# EAGLE board AM3352-SOM-EVB_Rev_E (EAGLE 4.16), part 1 of 3
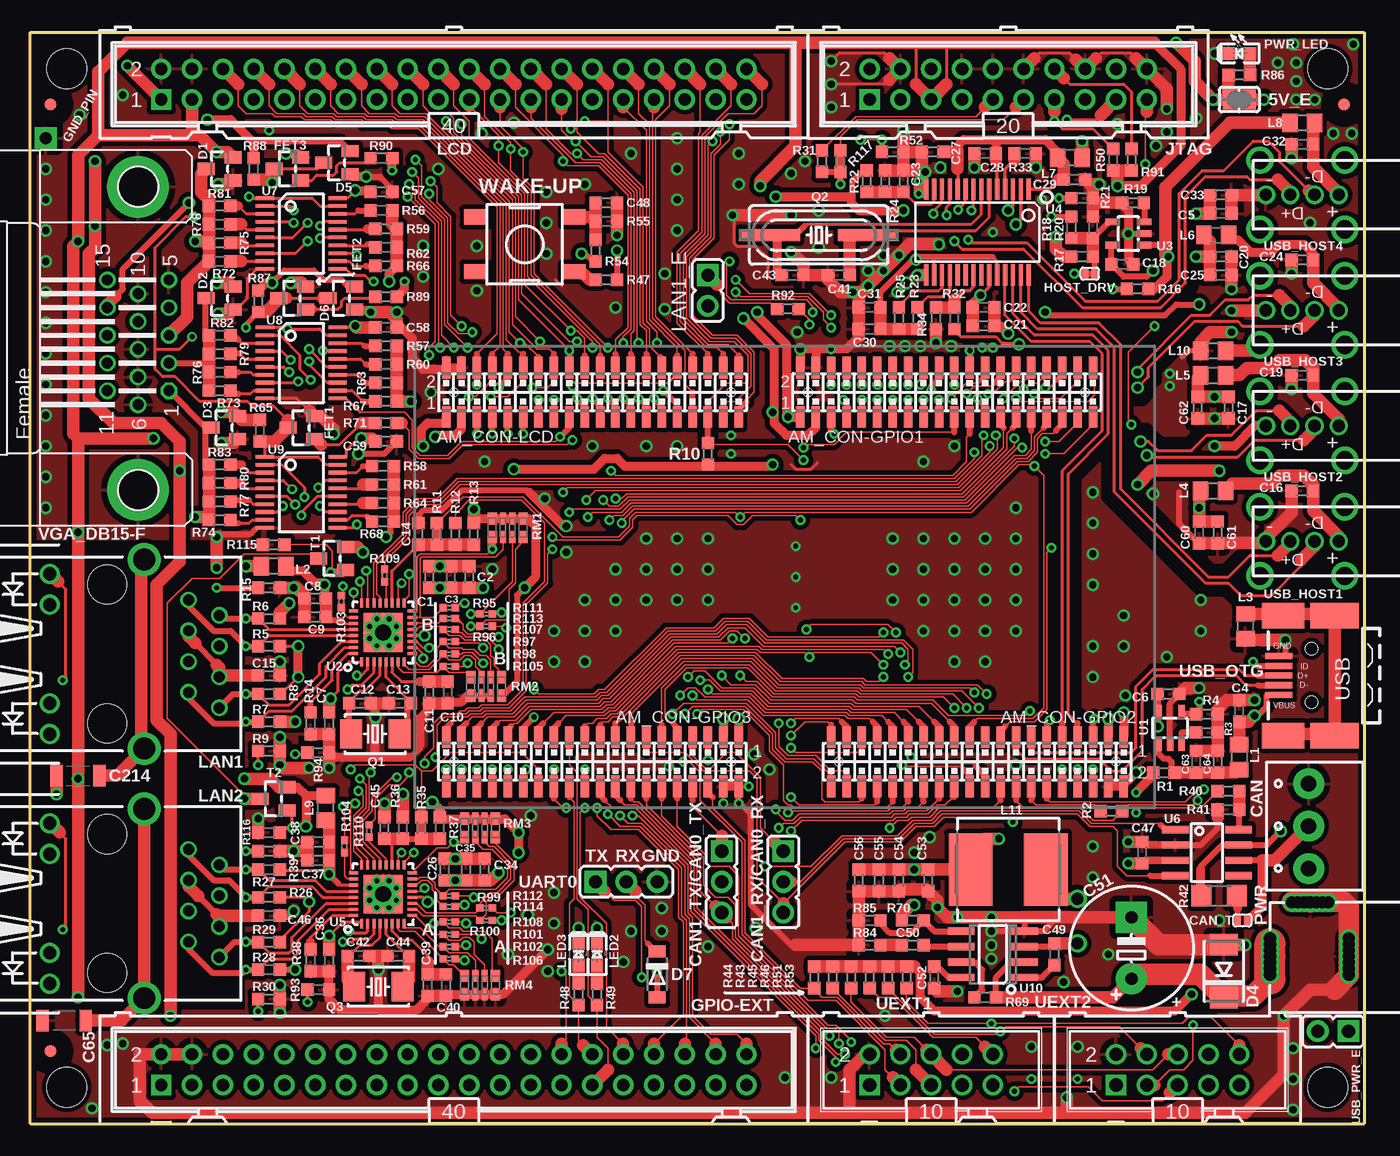
[diagram p2: board, top side]
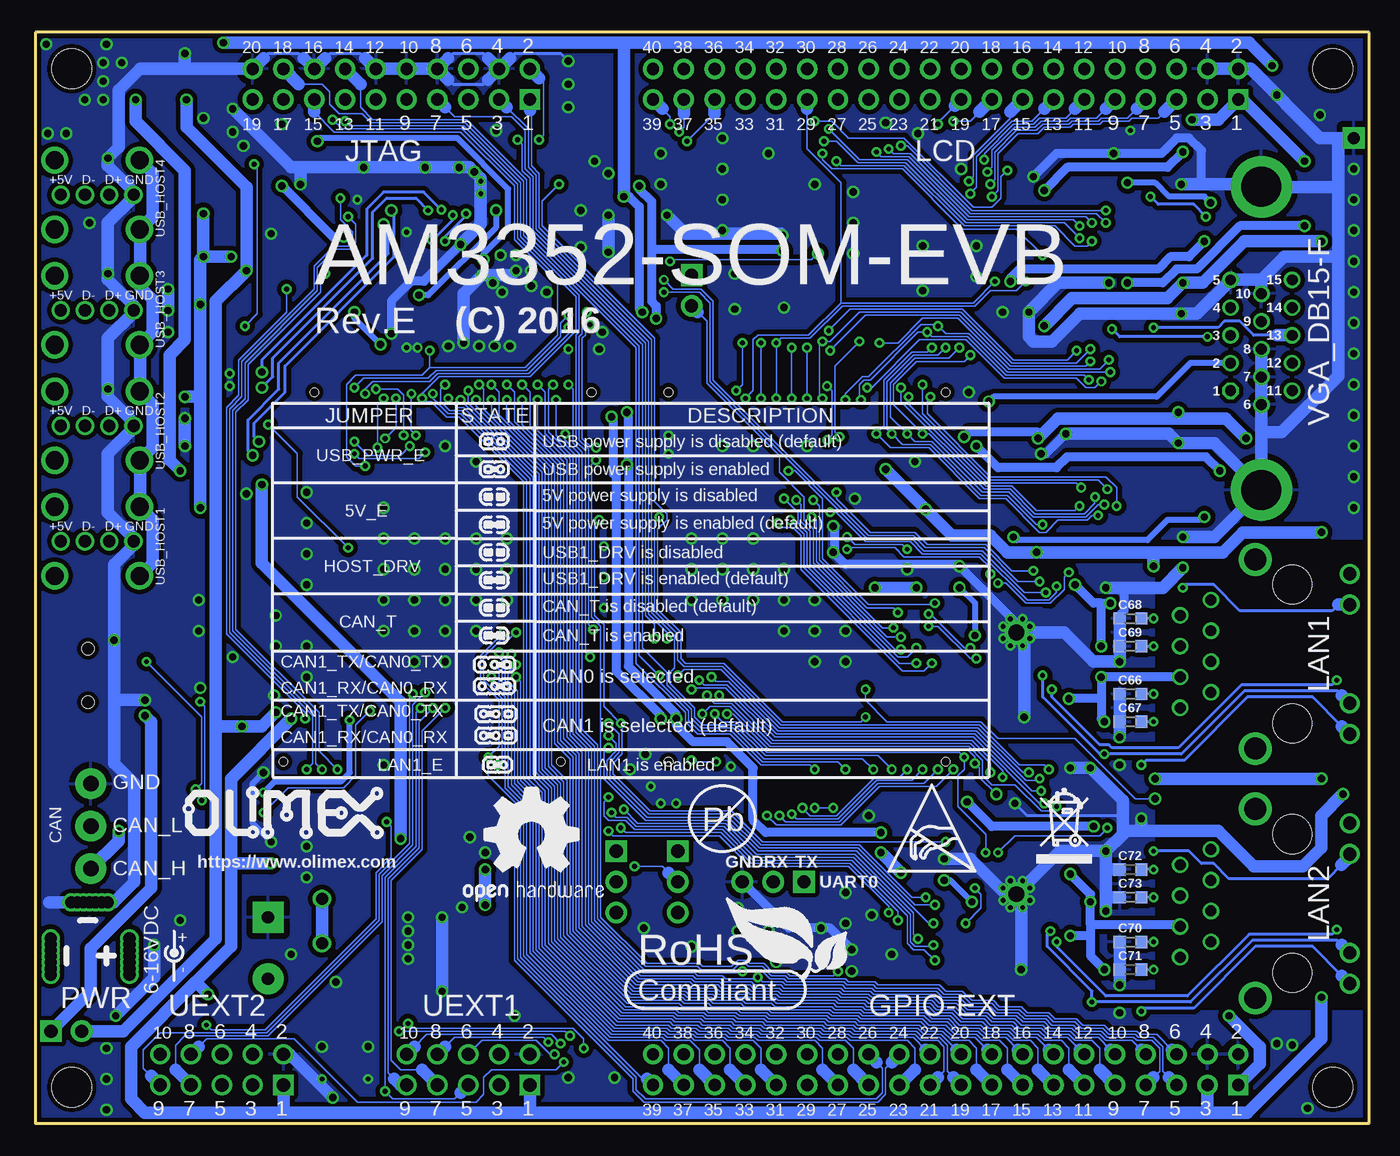
[diagram p3: board, bottom side, seen from below]

Size 110 x 90 mm. Coordinates in mm from the lower left corner, seen from the top.
Outline: 0,0 110,0 110,90 0,90 0,0
Copper layers (1+16): Top 0.035mm / dielectric 1.5mm / Bottom 0.035mm
Design rules "default": minimum track width 5mil, minimum drill 0.3mm, track to track 5mil, track to pad 5mil, pad to pad 5mil, via to via 5mil, smd to smd 1mil, copper to edge 10mil, drill to drill 8mil, minimum pad ring 8mil, minimum via ring 8mil, stop-mask expansion 4mil, vias tented up to drill 25mil, thermal gap 20mil
Net classes: 2 lan_sh: drill 0.762 mm
Holes 3.3 mm at 3,3 107,3 107,87 3,87
tRestrict: 25 lines

## Footprints (pad centres in the part's own frame; a part is rotated, then mirrored left to right if it is on the bottom)
SJ-CLOSE = smd 1.168 x 1.6: 1 -0.762,0; 2 0.762,0
AM3352-SOM-EVB = smd 0.7 x 1.8: 1-1 -27.94,13.208; 1-2 -27.94,17.272; 1-3 -26.67,13.208; 1-4 -26.67,17.272; 1-5 -25.4,13.208; 1-6 -25.4,17.272; 1-7 -24.13,13.208; 1-8 -24.13,17.272; 1-9 -22.86,13.208; 1-10 -22.86,17.272; 1-11 -21.59,13.208; 1-12 -21.59,17.272; 1-13 -20.32,13.208; 1-14 -20.32,17.272; 1-15 -19.05,13.208; 1-16 -19.05,17.272; 1-17 -17.78,13.208; 1-18 -17.78,17.272; 1-19 -16.51,13.208; 1-20 -16.51,17.272; 1-21 -15.24,13.208; 1-22 -15.24,17.272; 1-23 -13.97,13.208; 1-24 -13.97,17.272; 1-25 -12.7,13.208; 1-26 -12.7,17.272; 1-27 -11.43,13.208; 1-28 -11.43,17.272; 1-29 -10.16,13.208; 1-30 -10.16,17.272; 1-31 -8.89,13.208; 1-32 -8.89,17.272; 1-33 -7.62,13.208; 1-34 -7.62,17.272; 1-35 -6.35,13.208; 1-36 -6.35,17.272; 1-37 -5.08,13.208; 1-38 -5.08,17.272; 1-39 -3.81,13.208; 1-40 -3.81,17.272; 2-1 1.27,13.208; 2-2 1.27,17.272; 2-3 2.54,13.208; 2-4 2.54,17.272; 2-5 3.81,13.208; 2-6 3.81,17.272; 2-7 5.08,13.208; 2-8 5.08,17.272; 2-9 6.35,13.208; 2-10 6.35,17.272; 2-11 7.62,13.208; 2-12 7.62,17.272; 2-13 8.89,13.208; 2-14 8.89,17.272; 2-15 10.16,13.208; 2-16 10.16,17.272; 2-17 11.43,13.208; 2-18 11.43,17.272; 2-19 12.7,13.208; 2-20 12.7,17.272; 2-21 13.97,13.208; 2-22 13.97,17.272; 2-23 15.24,13.208; 2-24 15.24,17.272; 2-25 16.51,13.208; 2-26 16.51,17.272; 2-27 17.78,13.208; 2-28 17.78,17.272; 2-29 19.05,13.208; 2-30 19.05,17.272; 2-31 20.32,13.208; 2-32 20.32,17.272; 2-33 21.59,13.208; 2-34 21.59,17.272; 2-35 22.86,13.208; 2-36 22.86,17.272; 2-37 24.13,13.208; 2-38 24.13,17.272; 2-39 25.4,13.208; 2-40 25.4,17.272; 3-1 27.94,-13.208; 3-2 27.94,-17.272; 3-3 26.67,-13.208; 3-4 26.67,-17.272; 3-5 25.4,-13.208; 3-6 25.4,-17.272; 3-7 24.13,-13.208; 3-8 24.13,-17.272; 3-9 22.86,-13.208; 3-10 22.86,-17.272; 3-11 21.59,-13.208; 3-12 21.59,-17.272; 3-13 20.32,-13.208; 3-14 20.32,-17.272; 3-15 19.05,-13.208; 3-16 19.05,-17.272; 3-17 17.78,-13.208; 3-18 17.78,-17.272; 3-19 16.51,-13.208; 3-20 16.51,-17.272; 3-21 15.24,-13.208; 3-22 15.24,-17.272; 3-23 13.97,-13.208; 3-24 13.97,-17.272; 3-25 12.7,-13.208; 3-26 12.7,-17.272; 3-27 11.43,-13.208; 3-28 11.43,-17.272; 3-29 10.16,-13.208; 3-30 10.16,-17.272; 3-31 8.89,-13.208; 3-32 8.89,-17.272; 3-33 7.62,-13.208; 3-34 7.62,-17.272; 3-35 6.35,-13.208; 3-36 6.35,-17.272; 3-37 5.08,-13.208; 3-38 5.08,-17.272; 3-39 3.81,-13.208; 3-40 3.81,-17.272; 4-1 -3.81,-13.208; 4-2 -3.81,-17.272; 4-3 -5.08,-13.208; 4-4 -5.08,-17.272; 4-5 -6.35,-13.208; 4-6 -6.35,-17.272; 4-7 -7.62,-13.208; 4-8 -7.62,-17.272; 4-9 -8.89,-13.208; 4-10 -8.89,-17.272; 4-11 -10.16,-13.208; 4-12 -10.16,-17.272; 4-13 -11.43,-13.208; 4-14 -11.43,-17.272; 4-15 -12.7,-13.208; 4-16 -12.7,-17.272; 4-17 -13.97,-13.208; 4-18 -13.97,-17.272; 4-19 -15.24,-13.208; 4-20 -15.24,-17.272; 4-21 -16.51,-13.208; 4-22 -16.51,-17.272; 4-23 -17.78,-13.208; 4-24 -17.78,-17.272; 4-25 -19.05,-13.208; 4-26 -19.05,-17.272; 4-27 -20.32,-13.208; 4-28 -20.32,-17.272; 4-29 -21.59,-13.208; 4-30 -21.59,-17.272; 4-31 -22.86,-13.208; 4-32 -22.86,-17.272; 4-33 -24.13,-13.208; 4-34 -24.13,-17.272; 4-35 -25.4,-13.208; 4-36 -25.4,-17.272; 4-37 -26.67,-13.208; 4-38 -26.67,-17.272; 4-39 -27.94,-13.208; 4-40 -27.94,-17.272 | hole 0.7: -27.305,15.24; -4.445,15.24; 1.905,15.24; 24.765,15.24; 27.305,-15.24; 4.445,-15.24; -4.445,-15.24; -27.305,-15.24
C0603_DWS = smd 1.016 x 1.016: 1 -0.889,0; 2 0.889,0
E5-10,5 = drill 1.016 pad 2.54 round: + -2.54,0 | drill 1.016 pad 2.54 square: - 2.54,0
C1206_5MILS_WS_ISO = smd 1.016 x 1.778: 1 -1.778,0; 2 1.778,0
CON3/3.5MM = drill 1.27 pad 2.54 round: 1 -1.75,-0.5; 2 1.75,-0.5; 3 5.25,-0.5
JP2 = drill 1.1 pad 1.778 square: 1 -2.54,0 | drill 1.1 pad 1.778 round: 2 0,0; 3 2.54,0
SJ_1_SMALLER = smd 0.508 x 0.762: 1 -0.381,0; 2 0.381,0
SOT23C(BAT54S) = smd 1.4 x 1: 1 1.1,-0.95; 2 1.1,0.95; 3 -1.1,0
DO214AA = smd 1.778 x 2.286: A 2.177,0; C -2.177,0
SOD-123 = smd 1 x 1.4: A 1.9,0; C -1.9,0
SOT23 = smd 1.4 x 1: 1 1.1,-0.95; 2 1.1,0.95; 3 -1.1,0
FIDUCIAL-1X3 = smd 1 x 1: 1 0,0
TEST_PAD40/70/SQUARE = drill 1.016 pad 1.778 square: P$1 0,0
ML40 = drill 1.016 pad 1.676 square: 1 -24.13,-1.27 | drill 1.016 pad 1.676 round: 2 -24.13,1.27; 3 -21.59,-1.27; 4 -21.59,1.27; 5 -19.05,-1.27; 6 -19.05,1.27; 7 -16.51,-1.27; 8 -16.51,1.27; 9 -13.97,-1.27; 10 -13.97,1.27; 11 -11.43,-1.27; 12 -11.43,1.27; 13 -8.89,-1.27; 14 -8.89,1.27; 15 -6.35,-1.27; 16 -6.35,1.27; 17 -3.81,-1.27; 18 -3.81,1.27; 19 -1.27,-1.27; 20 -1.27,1.27; 21 1.27,-1.27; 22 1.27,1.27; 23 3.81,-1.27; 24 3.81,1.27; 25 6.35,-1.27; 26 6.35,1.27; 27 8.89,-1.27; 28 8.89,1.27; 29 11.43,-1.27; 30 11.43,1.27; 31 13.97,-1.27; 32 13.97,1.27; 33 16.51,-1.27; 34 16.51,1.27; 35 19.05,-1.27; 36 19.05,1.27; 37 21.59,-1.27; 38 21.59,1.27; 39 24.13,-1.27; 40 24.13,1.27
SJ_1_SMALLER_CLOSE = smd 0.508 x 0.762: 1 -0.381,0; 2 0.381,0
ML20-MALE = drill 1.016 pad 1.676 square: 1 -11.43,-1.27 | drill 1.016 pad 1.676 round: 2 -11.43,1.27; 3 -8.89,-1.27; 4 -8.89,1.27; 5 -6.35,-1.27; 6 -6.35,1.27; 7 -3.81,-1.27; 8 -3.81,1.27; 9 -1.27,-1.27; 10 -1.27,1.27; 11 1.27,-1.27; 12 1.27,1.27; 13 3.81,-1.27; 14 3.81,1.27; 15 6.35,-1.27; 16 6.35,1.27; 17 8.89,-1.27; 18 8.89,1.27; 19 11.43,-1.27; 20 11.43,1.27
L0805_5MIL_DWS = smd 1.27 x 1.524: 1 -1.016,0; 2 1.016,0
8X8MM_3131 = smd 3.6 x 6: 1 -3.1,0; 2 3.1,0
RJLBC-060TC1 = drill 0.9 round: 1 -4.455,6.7; 2 -3.185,9.24; 3 -1.915,6.7; 4 -0.645,9.24; 5 0.625,6.7; 6 1.895,9.24; 7 3.165,6.7; 8 4.435,9.24 | drill 1.1 round: AG 4.07,-4.748; AY -6.61,-4.748; KG 6.61,-4.748; KY -4.07,-4.748 | drill 1.8 round: GND1 -7.8,3.05; GND2 7.8,3.05 | hole 3.2: -5.715,0; 5.715,0
JP1 = drill 1.1 pad 1.778 square: 1 0,-1.27 | drill 1.1 pad 1.778 round: 2 0,1.27
LED_0603 = smd 1.016 x 1.016: A 0.889,0; C -0.889,0
PWR_JACK_UNI_MILLING = drill 1 round: + 0,4.75; +1 0,5.25; +2 0,5.75; +3 0,6.25; +4 0,4.25; +5 0,3.75; +6 0,3.25; - -6.5,4.75; -1 -6.5,5.25; -2 -6.5,5.75; -3 -6.5,4.25; -4 -6.5,3.75; -5 -6.5,6.25; -6 -6.5,3.25; -- -3.3,0.3; --1 -3.8,0.3; --2 -4.3,0.3; --3 -4.8,0.3; --4 -2.8,0.3; --5 -2.3,0.3; --6 -1.8,0.3
LED-0603 = smd 1.016 x 1.016: A 0.889,0; C -0.889,0
HCX-4S = smd 1.8 x 2.4: 1 -2,0; 2 2,0
HC49/SMD2_THIN = smd 5 x 1: 1 -4.064,0; 2 4.064,0
R0603_5MIL_DWS = smd 1.016 x 1.016: 1 -0.889,0; 2 0.889,0
0603_0R = smd 1.016 x 1.016: 1 -0.889,0; 2 0.889,0
R1206_5MIL_WS = smd 1.651 x 1.778: 1 -1.46,0; 2 1.46,0
R0402_TI = smd 0.61 x 0.584: 1 -0.508,0; 2 0.508,0
R_MATRIX_4 = smd 0.762 x 1.016: 1.1 -1.27,-0.762; 1.2 -1.27,0.762; 4.1 1.27,-0.762; 4.2 1.27,0.762 | smd 0.508 x 1.016: 2.1 -0.381,-0.762; 2.2 -0.381,0.762; 3.1 0.381,-0.762; 3.2 0.381,0.762
SOT-23 = smd 1.4 x 1: 1 1.1,-0.95; 2 1.1,0.95; 3 -1.1,0
SOT23-5 = smd 1.2 x 0.55: 1 1.3,-0.95; 2 1.3,0; 3 1.3,0.95; 4 -1.3,0.95; 5 -1.3,-0.95
QFN-32(DRILLS) = smd 0.25 x 0.75: 1 -1.75,-2.425; 2 -1.25,-2.425; 3 -0.75,-2.425; 4 -0.25,-2.425; 5 0.25,-2.425; 6 0.75,-2.425; 7 1.25,-2.425; 8 1.75,-2.425; 17 1.75,2.425; 18 1.25,2.425; 19 0.75,2.425; 20 0.25,2.425; 21 -0.25,2.425; 22 -0.75,2.425; 23 -1.25,2.425; 24 -1.75,2.425 | smd 0.75 x 0.25: 9 2.425,-1.75; 10 2.425,-1.25; 11 2.425,-0.75; 12 2.425,-0.25; 13 2.425,0.25; 14 2.425,0.75; 15 2.425,1.25; 16 2.425,1.75; 25 -2.425,1.75; 26 -2.425,1.25; 27 -2.425,0.75; 28 -2.425,0.25; 29 -2.425,-0.25; 30 -2.425,-0.75; 31 -2.425,-1.25; 32 -2.425,-1.75 | drill 1.3 round: EP1 0,0 | drill 0.4 round: EP2 -0.5,1.1; EP3 0.5,1.1; EP4 1.1,0.5; EP5 1.1,-0.5; EP6 0.5,-1.1; EP7 -0.5,-1.1; EP8 -1.1,-0.5; EP9 -1.1,0.5 | smd 3.2 x 3.2: EXP_PAD 0,0
SSOP28 = smd 0.35 x 1.75: 1 -4.225,-3.525; 2 -3.575,-3.525; 3 -2.925,-3.525; 4 -2.275,-3.525; 5 -1.625,-3.525; 6 -0.975,-3.525; 7 -0.325,-3.525; 8 0.325,-3.525; 9 0.975,-3.525; 10 1.625,-3.525; 11 2.275,-3.525; 12 2.925,-3.525; 13 3.575,-3.525; 14 4.225,-3.525; 15 4.225,3.525; 16 3.575,3.525; 17 2.925,3.525; 18 2.275,3.525; 19 1.625,3.525; 20 0.975,3.525; 21 0.325,3.525; 22 -0.325,3.525; 23 -0.975,3.525; 24 -1.625,3.525; 25 -2.275,3.525; 26 -2.925,3.525; 27 -3.575,3.525; 28 -4.225,3.525
SO-08 = smd 0.6 x 2.2: 1 -1.905,-2.6; 2 -0.635,-2.6; 3 0.635,-2.6; 4 1.905,-2.6; 5 1.905,2.6; 6 0.635,2.6; 7 -0.635,2.6; 8 -1.905,2.6
PW = smd 0.3 x 1.5: 1 -2.925,-3; 2 -2.275,-3; 3 -1.625,-3; 4 -0.975,-3; 5 -0.325,-3; 6 0.325,-3; 7 0.975,-3; 8 1.625,-3; 9 2.275,-3; 10 2.925,-3; 11 2.925,3; 12 2.275,3; 13 1.625,3; 14 0.975,3; 15 0.325,3; 16 -0.325,3; 17 -0.975,3; 18 -1.625,3; 19 -2.275,3; 20 -2.925,3
SOIC8 = smd 0.6 x 2.2: 1 -1.905,-2.6; 2 -0.635,-2.6; 3 0.635,-2.6; 4 1.905,-2.6; 5 1.905,2.6; 6 0.635,2.6; 7 -0.635,2.6; 8 -1.905,2.6
ML10-MALE = drill 1.1 pad 1.676 square: 1 -5.08,-1.27 | drill 1.1 pad 1.676 round: 2 -5.08,1.27; 3 -2.54,-1.27; 4 -2.54,1.27; 5 0,-1.27; 6 0,1.27; 7 2.54,-1.27; 8 2.54,1.27; 9 5.08,-1.27; 10 5.08,1.27
USB_A_VERTICAL_PTH = drill 1 round: 1 3.45,12.75; 2 3.45,14.75; 3 3.45,16.75; 4 3.45,18.75 | drill 1.5 round: P$1 0.6,12.25; P$2 6.3,12.25; P$3 6.3,19.25; P$4 0.6,19.25
USB_MINI_9PIN = smd 2.25 x 0.5: D+ -3.722,0; D- -3.722,-0.8; GND -3.722,1.6; ID -3.722,0.8; VBUS -3.722,-1.6 | smd 4 x 2.1: GND1 0.884,-4.95; GND3 0.884,4.95 | smd 3.5 x 2.1: GND2 -3.366,-4.95; GND4 -3.366,4.95 | hole 1: -1.016,-2.2; -1.016,2.2
DB15-F_22MM = drill 0.9 octagon: 1 4.329,6.35 | drill 0.9 round: 2 2.043,6.35; 3 -0.243,6.35; 4 -2.529,6.35; 5 -4.815,6.35; 6 5.472,3.81; 7 3.186,3.81; 8 0.9,3.81; 9 -1.386,3.81; 10 -3.672,3.81; 11 4.329,1.27; 12 2.043,1.27; 13 -0.243,1.27; 14 -2.529,1.27; 15 -4.815,1.27 | drill 3.302 pad 5.08 round: GND1 -12.497,3.81; GND2 12.497,3.81
T1157 = smd 1.27 x 1.905: 1 -2.25,4.054; 2 2.25,4.054; 3 2.25,-4.054; 4 -2.25,-4.054

## Placement (x,y rotation side)
5V_E  Close  [SJ-CLOSE]  99.69,84.45 180 top
AM3352-SOM-EVB-PLATFORM  4XGPH127SMT-02X20(PA-V16X-2X20-LF)  [AM3352-SOM-EVB]  62.23,45.09 0 top
C1  100nF  [C0603_DWS]  32.89,45.09 270 top
C2  22uF/6.3V  [C0603_DWS]  36.2,45.09 270 top
C3  22uF/6.3V  [C0603_DWS]  34.67,45.09 270 top
C4  100nF  [C0603_DWS]  99.69,34.04 90 top
C5  22uF/6.3V  [C0603_DWS]  98.17,75.06 0 top
C6  100nF  [C0603_DWS]  93.85,35.43 0 top
C7  100nF  [C0603_DWS]  24.64,33.02 90 top
C8  100nF  [C0603_DWS]  23.5,43.31 0 top
C9  22uF/6.3V  [C0603_DWS]  23.5,41.78 0 top
C10  470pF  [C0603_DWS]  34.42,35.56 90 top
C11  1uF  [C0603_DWS]  32.89,35.56 90 top
C12  33pF  [C0603_DWS]  27.18,34.67 180 top
C13  33pF  [C0603_DWS]  30.48,34.67 0 top
C14  NA  [C0603_DWS]  32,48.64 270 top
C15  22nF  [C0603_DWS]  19.68,36.96 180 top
C16  100nF  [C0603_DWS]  104.9,52.2 180 top
C17  22uF/6.3V  [C0603_DWS]  98.81,59.05 270 top
C18  22uF/6.3V  [C0603_DWS]  90.04,70.87 0 top
C19  100nF  [C0603_DWS]  104.9,61.72 180 top
C20  22uF/6.3V  [C0603_DWS]  98.17,71.5 0 top
C21  22uF/6.3V  [C0603_DWS]  78.61,65.79 0 top
C22  100nF  [C0603_DWS]  78.61,67.31 0 top
C23  1uF  [C0603_DWS]  72.01,77.72 270 top
C24  100nF  [C0603_DWS]  104.9,71.25 180 top
C25  22uF/6.3V  [C0603_DWS]  98.17,69.98 0 top
C26  100nF  [C0603_DWS]  34.16,20.95 270 top
C27  100nF  [C0603_DWS]  74.42,80.14 180 top
C28  100nF  [C0603_DWS]  78.74,80.01 180 top
C29  100nF  [C0603_DWS]  86.11,77.85 0 top
C30  22uF/6.3V  [C0603_DWS]  69.22,65.53 180 top
C31  100nF  [C0603_DWS]  69.22,67.31 180 top
C32  100nF  [C0603_DWS]  104.9,80.77 180 top
C33  22uF/6.3V  [C0603_DWS]  98.17,76.58 0 top
C34  22uF/6.3V  [C0603_DWS]  37.47,20.95 270 top
C35  22uF/6.3V  [C0603_DWS]  35.94,20.95 270 top
C36  100nF  [C0603_DWS]  24.64,13.46 90 top
C37  100nF  [C0603_DWS]  23.75,21.72 0 top
C38  22uF/6.3V  [C0603_DWS]  23.75,23.24 0 top
C39  470pF  [C0603_DWS]  32.77,11.43 90 top
C40  1uF  [C0603_DWS]  34.29,11.43 90 top
C41  33pF  [C0603_DWS]  66.67,69.98 0 top
C42  33pF  [C0603_DWS]  27.05,13.84 180 top
C43  33pF  [C0603_DWS]  62.87,69.98 180 top
C44  33pF  [C0603_DWS]  30.35,13.84 0 top
C45  NA  [C0603_DWS]  29.21,24.38 270 top
C46  22nF  [C0603_DWS]  19.68,17.14 180 top
C47  100nF  [C0603_DWS]  91.69,22.35 90 top
C48  100nF  [C0603_DWS]  47.5,75.95 0 top
C49  10nF  [C0603_DWS]  84.45,13.97 90 top
C50  3.3nF  [C0603_DWS]  72.77,14.73 180 top
C51  470uF/25V/LOWESR/105C  [E5-10,5]  90.81,14.48 90 top
C52  100nF  [C0603_DWS]  74.55,12.06 270 top
C53  22uF/6.3V  [C0603_DWS]  74.04,20.07 270 top
C54  22uF/6.3V  [C0603_DWS]  71.63,20.07 270 top
C55  22uF/6.3V  [C0603_DWS]  69.98,20.07 270 top
C56  22uF/6.3V  [C0603_DWS]  68.33,20.07 270 top
C57  100nF  [C0603_DWS]  28.96,76.83 0 top
C58  100nF  [C0603_DWS]  29.34,65.66 0 top
C59  100nF  [C0603_DWS]  29.34,56.26 0 top
C60  22uF/6.3V  [C0603_DWS]  96.39,48.77 270 top
C61  22uF/6.3V  [C0603_DWS]  97.92,48.77 270 top
C62  22uF/6.3V  [C0603_DWS]  96.27,59.05 270 top
C63  22uF/6.3V  [C0603_DWS]  96.14,29.84 90 top
C64  22uF/6.3V  [C0603_DWS]  97.92,29.84 90 top
C65  1nF/2kV/X7R/1206  [C1206_5MILS_WS_ISO]  2.79,8.51 0 top
C66  NA  [C0603_DWS]  19.68,35.43 0 bottom
C67  NA  [C0603_DWS]  19.68,33.15 0 bottom
C68  NA  [C0603_DWS]  19.68,41.66 0 bottom
C69  NA  [C0603_DWS]  19.68,39.37 0 bottom
C70  NA  [C0603_DWS]  19.68,14.99 0 bottom
C71  NA  [C0603_DWS]  19.68,12.7 0 bottom
C72  NA  [C0603_DWS]  19.68,20.95 0 bottom
C73  NA  [C0603_DWS]  19.68,18.67 0 bottom
C214  1nF/2kV/X7R/1206  [C1206_5MILS_WS_ISO]  3.94,28.7 0 top
CAN  TB3-3.5mm  [CON3/3.5MM]  105.92,26.29 270 top
CAN1_RX/CAN0_RX  HN1x3(CAN1_RX:Close/CAN0_RX:Open)  [JP2]  62.1,19.94 270 top
CAN1_TX/CAN0_TX  HN1x3(CAN1_TX:Close/CAN0_TX:Open)  [JP2]  57.02,19.94 270 top
CAN_T  Open  [SJ_1_SMALLER]  99.95,16.76 0 top
D1  BAT54S  [SOT23C(BAT54S)]  15.62,78.74 0 top
D2  BAT54S  [SOT23C(BAT54S)]  15.62,68.07 0 top
D3  BAT54S  [SOT23C(BAT54S)]  16,57.4 0 top
D4  SMBJ16A  [DO214AA]  98.42,12.57 90 top
D5  BAT54S  [SOT23C(BAT54S)]  25.27,79.25 0 top
D6  BAT54S  [SOT23C(BAT54S)]  25.65,68.07 0 top
D7  1N5819(S4SOD-123)  [SOD-123]  51.69,12.32 270 top
FET1  BSS138  [SOT23]  22.35,57.4 0 top
FET2  BSS138  [SOT23]  21.59,68.07 0 top
FET3  BSS138  [SOT23]  21.21,78.74 0 top
FID1  FIDUCIAL  [FIDUCIAL-1X3]  108.33,84.07 180 top
FID2  FIDUCIAL  [FIDUCIAL-1X3]  1.65,84.07 180 top
FID3  FIDUCIAL  [FIDUCIAL-1X3]  1.65,5.97 180 top
GND_PIN  TESTPAD3  [TEST_PAD40/70/SQUARE]  1.27,81.28 180 top
GPIO-EXT  BH40S  [ML40]  34.92,4.45 0 top
HOST_DRV  Close  [SJ_1_SMALLER_CLOSE]  87.38,70.1 0 top
JTAG  ML20  [ML20-MALE]  80.64,85.72 0 top
L1  FB0805/600R/2A  [L0805_5MIL_DWS]  99.69,30.23 270 top
L2  FB0805/600R/2A  [L0805_5MIL_DWS]  20.07,45.97 180 top
L3  FB0805/600R/200mA(201209-601)  [L0805_5MIL_DWS]  100.2,41.02 90 top
L4  FB0805/600R/2A  [L0805_5MIL_DWS]  97.54,52.2 0 top
L5  FB0805/600R/2A  [L0805_5MIL_DWS]  97.54,61.72 0 top
L6  FB0805/600R/2A  [L0805_5MIL_DWS]  97.79,73.28 0 top
L7  FB0805/600R/2A  [L0805_5MIL_DWS]  85.72,79.63 180 top
L8  FB0805/600R/2A  [L0805_5MIL_DWS]  104.9,82.55 0 top
L9  FB0805/600R/2A  [L0805_5MIL_DWS]  24.38,26.04 90 top
L10  FB0805/600R/2A  [L0805_5MIL_DWS]  97.54,63.75 0 top
L11  10uH/3.15A/20%  [8X8MM_3131]  80.64,20.95 180 top
LAN1  RJLBC-060TC1  [RJLBC-060TC1]  6.35,38.73 270 top
LAN1_E  HN1x2  [JP1]  55.88,68.71 180 top
LAN2  RJLBC-060TC1  [RJLBC-060TC1]  6.35,18.16 270 top
LCD  BH40S  [ML40]  34.92,85.72 0 top
LED2  LED/Red/0603  [LED_0603]  46.74,13.97 270 top
LED3  LED/Yellow/0603  [LED_0603]  45.21,13.97 270 top
PWR  YDJ-1136  [PWR_JACK_UNI_MILLING]  102.23,18.54 180 top
PWR_LED  LED/Red/0603  [LED-0603]  99.69,88.27 0 top
Q1  E4SB25.000F20E15  [HCX-4S]  28.45,32.13 180 top
Q2  Q12.000MHz/HC-49SM/SMD/20ppm/20pF  [HC49/SMD2_THIN]  65.02,73.28 0 top
Q3  E4SB25.000F20E15  [HCX-4S]  28.7,11.3 180 top
R1  2.2k/1%  [R0603_5MIL_DWS]  93.47,28.96 0 top
R2  NA  [R0603_5MIL_DWS]  89.15,25.78 180 top
R3  13k/1%  [R0603_5MIL_DWS]  97.03,32.26 180 top
R4  10k  [R0603_5MIL_DWS]  97.03,33.78 180 top
R5  49.9R/1%  [R0603_5MIL_DWS]  19.68,39.37 0 top
R6  49.9R/1%  [R0603_5MIL_DWS]  19.68,41.66 0 top
R7  49.9R/1%  [R0603_5MIL_DWS]  19.68,33.15 0 top
R8  49.9R/1%  [R0603_5MIL_DWS]  19.68,35.43 0 top
R9  549R/1%  [R0603_5MIL_DWS]  19.68,30.73 0 top
R10  4.99k/1%  [R0603_5MIL_DWS]  55.88,55.24 90 top
R11  0R(Board_Mounted)  [0603_0R]  33.53,48.64 270 top
R12  NA  [R0603_5MIL_DWS]  35.05,48.64 270 top
R13  NA  [R0603_5MIL_DWS]  36.58,48.64 270 top
R14  12.1k/1%  [R0603_5MIL_DWS]  23.11,33.02 90 top
R15  549R/1%  [R0603_5MIL_DWS]  19.68,44.2 0 top
R16  2.2k/1%  [R0603_5MIL_DWS]  91.31,68.83 0 top
R17  NA  [R0603_5MIL_DWS]  86.74,71.5 0 top
R18  NA  [R0603_5MIL_DWS]  85.85,73.91 270 top
R19  6.8k/1%  [R0603_5MIL_DWS]  90.93,75.95 0 top
R20  10k  [R0603_5MIL_DWS]  87.63,73.91 270 top
R21  10k  [R0603_5MIL_DWS]  86.74,76.33 0 top
R22  10k  [R0603_5MIL_DWS]  68.96,77.72 90 top
R23  10k  [R0603_5MIL_DWS]  73.15,66.42 90 top
R24  NA(47k)  [R0603_5MIL_DWS]  70.48,77.72 90 top
R25  10k  [R0603_5MIL_DWS]  71.63,66.42 90 top
R26  49.9R/1%  [R0603_5MIL_DWS]  19.68,18.67 0 top
R27  49.9R/1%  [R0603_5MIL_DWS]  19.68,20.95 0 top
R28  49.9R/1%  [R0603_5MIL_DWS]  19.68,12.7 0 top
R29  49.9R/1%  [R0603_5MIL_DWS]  19.68,14.99 0 top
R30  549R/1%  [R0603_5MIL_DWS]  19.68,10.29 0 top
R31  22R  [R0603_5MIL_DWS]  65.28,79.38 90 top
R32  NA(5.1k)  [R0603_5MIL_DWS]  76.2,66.42 270 top
R33  680R/1%  [R0603_5MIL_DWS]  82.04,80.01 180 top
R34  NA(10k)  [R0603_5MIL_DWS]  74.68,66.42 90 top
R35  0R(Board_Mounted)  [0603_0R]  32.26,24.38 270 top
R36  NA  [R0603_5MIL_DWS]  30.73,24.38 270 top
R37  NA  [R0603_5MIL_DWS]  33.78,24.38 270 top
R38  12.1k/1%  [R0603_5MIL_DWS]  23.11,13.46 90 top
R39  549R/1%  [R0603_5MIL_DWS]  19.68,22.48 0 top
R40  NA  [R0603_5MIL_DWS]  98.81,27.43 180 top
R41  10k  [R0603_5MIL_DWS]  98.81,25.91 180 top
R42  120R  [R1206_5MIL_WS]  98.04,18.8 180 top
R43  NA  [R0603_5MIL_DWS]  66.17,12.06 90 top
R44  NA  [R0603_5MIL_DWS]  64.64,12.06 90 top
R45  NA  [R0603_5MIL_DWS]  67.69,12.06 90 top
R46  NA  [R0603_5MIL_DWS]  69.22,12.06 90 top
R47  2.2k/1%  [R0603_5MIL_DWS]  47.5,69.6 0 top
R48  2.2k/1%  [R0603_5MIL_DWS]  45.21,10.67 90 top
R49  2.2k/1%  [R0603_5MIL_DWS]  46.74,10.67 90 top
R50  10k  [R0603_5MIL_DWS]  89.28,79.5 270 top
R51  NA  [R0603_5MIL_DWS]  70.74,12.06 90 top
R52  NA(10k)  [R0603_5MIL_DWS]  71.12,80.14 180 top
R53  NA  [R0603_5MIL_DWS]  72.26,12.06 90 top
R54  49.9R/1%  [R0603_5MIL_DWS]  46.61,72.01 90 top
R55  NA  [R0603_5MIL_DWS]  47.5,74.42 0 top
R56  71.5k/1%  [R0603_5MIL_DWS]  28.96,75.31 0 top
R57  71.5k/1%  [R0603_5MIL_DWS]  29.34,64.14 0 top
R58  71.5k/1%  [R0603_5MIL_DWS]  29.08,54.23 0 top
R59  35.7k/1%  [R0603_5MIL_DWS]  29.34,73.79 0 top
R60  35.7k/1%  [R0603_5MIL_DWS]  29.34,62.61 0 top
R61  35.7k/1%  [R0603_5MIL_DWS]  29.08,52.7 0 top
R62  17.8k/1%  [R0603_5MIL_DWS]  29.34,72.26 0 top
R63  17.8k/1%  [R0603_5MIL_DWS]  29.34,61.09 0 top
R64  17.8k/1%  [R0603_5MIL_DWS]  29.08,51.18 0 top
R65  1.05k/1%  [R0603_5MIL_DWS]  18.92,57.15 90 top
R66  8.66k/1%  [R0603_5MIL_DWS]  29.34,70.74 0 top
R67  8.66k/1%  [R0603_5MIL_DWS]  29.34,59.56 0 top
R68  8.66k/1%  [R0603_5MIL_DWS]  29.08,49.66 0 top
R69  10k  [R0603_5MIL_DWS]  78.74,10.41 180 top
R70  4.99k/1%  [R0603_5MIL_DWS]  72.77,16.76 180 top
R71  49.9R/1%  [R0603_5MIL_DWS]  29.34,57.78 180 top
R72  4.32k/1%  [R0603_5MIL_DWS]  15.62,71.12 180 top
R73  4.32k/1%  [R0603_5MIL_DWS]  15.62,60.45 180 top
R74  4.32k/1%  [R0603_5MIL_DWS]  15.62,49.78 180 top
R75  2.2k/1%  [R0603_5MIL_DWS]  15.62,72.64 180 top
R76  2.2k/1%  [R0603_5MIL_DWS]  15.62,61.98 180 top
R77  2.2k/1%  [R0603_5MIL_DWS]  15.62,51.31 180 top
R78  1.05k/1%  [R0603_5MIL_DWS]  15.62,74.17 180 top
R79  1.05k/1%  [R0603_5MIL_DWS]  15.62,63.5 180 top
R80  1.05k/1%  [R0603_5MIL_DWS]  15.62,52.83 180 top
R81  549R/1%  [R0603_5MIL_DWS]  15.62,75.69 180 top
R82  549R/1%  [R0603_5MIL_DWS]  15.62,65.02 180 top
R83  549R/1%  [R0603_5MIL_DWS]  15.62,54.36 180 top
R84  2.2k/1%  [R0603_5MIL_DWS]  69.22,14.73 180 top
R85  1.05k/1%  [R0603_5MIL_DWS]  69.22,16.76 180 top
R86  2.2k/1%  [R0603_5MIL_DWS]  99.69,86.49 0 top
R87  1.05k/1%  [R0603_5MIL_DWS]  18.8,67.82 90 top
R88  1.05k/1%  [R0603_5MIL_DWS]  18.41,78.74 90 top
R89  49.9R/1%  [R0603_5MIL_DWS]  29.34,68.2 180 top
R90  49.9R/1%  [R0603_5MIL_DWS]  28.96,79.63 180 top
R91  10k  [R0603_5MIL_DWS]  90.81,79.5 270 top
R92  0R  [R0603_5MIL_DWS]  62.48,67.18 0 top
R93  10k  [R0603_5MIL_DWS]  23.75,11.05 0 top
R94  10k  [R0603_5MIL_DWS]  23.75,30.61 0 top
R95  100R/1%  [R0402_TI]  37.59,42.04 180 top
R96  100R/1%  [R0402_TI]  37.59,41.02 180 top
R97  100R/1%  [R0402_TI]  34.54,39.75 180 top
R98  100R/1%  [R0402_TI]  34.54,38.73 180 top
R99  100R/1%  [R0402_TI]  37.59,17.78 180 top
R100  100R/1%  [R0402_TI]  37.59,16.76 180 top
R101  100R/1%  [R0402_TI]  34.54,15.62 180 top
R102  100R/1%  [R0402_TI]  34.54,14.61 180 top
R103  100R/1%  [R0402_TI]  25.65,43.05 270 top
R104  100R/1%  [R0402_TI]  25.91,22.86 270 top
R105  100R/1%  [R0402_TI]  34.54,37.72 180 top
R106  100R/1%  [R0402_TI]  34.54,13.59 180 top
R107  100R/1%  [R0402_TI]  34.54,40.77 180 top
R108  100R/1%  [R0402_TI]  34.54,16.64 180 top
R109  100R/1%  [R0402_TI]  29.21,45.21 270 top
R110  100R/1%  [R0402_TI]  27.94,24.13 270 top
R111  100R/1%  [R0402_TI]  34.54,42.55 180 top
R112  100R/1%  [R0402_TI]  34.54,18.8 180 top
R113  100R/1%  [R0402_TI]  34.54,41.66 180 top
R114  100R/1%  [R0402_TI]  34.54,17.91 180 top
R115  10k  [R0603_5MIL_DWS]  20.07,47.75 0 top
R116  10k  [R0603_5MIL_DWS]  19.68,24 0 top
R117  0R(Board_Mounted)  [0603_0R]  66.8,79.38 90 top
RM1  RA1206_(4X0603)_4B8_1.5k  [R_MATRIX_4]  39.37,49.15 180 top
RM2  RA1206_(4X0603)_4B8_10k  [R_MATRIX_4]  37.59,36.07 180 top
RM3  RA1206_(4X0603)_4B8_1.5k  [R_MATRIX_4]  37.08,24.38 180 top
RM4  RA1206_(4X0603)_4B8_10k  [R_MATRIX_4]  37.08,11.43 180 top
T1  NA(DTA114YKA)  [SOT-23]  24.89,46.61 0 top
T2  NA(DTA114YKA)  [SOT-23]  20.07,26.8 0 top
U1  SY6280  [SOT23-5]  93.98,32.64 270 top
U2  LAN8710A-EZC  [QFN-32(DRILLS)]  29.08,40.51 0 top
U3  SY6280  [SOT23-5]  90.55,73.41 0 top
U4  GL850G-HHGXX  [SSOP28]  78.11,73.53 180 top
U5  LAN8710A-EZC  [QFN-32(DRILLS)]  29.08,18.92 0 top
U6  SN65HVD230(SO8)  [SO-08]  97.03,22.35 270 top
U7  SN74ALVC244  [PW]  22.35,73.41 270 top
U8  SN74ALVC244  [PW]  22.35,62.74 270 top
U9  SN74ALVC244  [PW]  22.35,52.07 270 top
U10  MP1482DS  [SOIC8]  79.38,13.97 90 top
U$5  [LOGO-OPENHARDWARE_8X8]  69.09,23.75 0 bottom
U$8  [OLIMEX1_V]  80.14,23.37 0 bottom
U$9  [PB]  53.34,25.15 0 bottom
U$10  [ESD_SYMBOL]  39.62,20.83 0 bottom
U$11  [RECYCLE_BIN1/8]  27.43,21.46 0 bottom
U$12  [ROHS]  60.33,10.16 0 bottom
UART0  HN1X3  [JP2]  49.15,19.94 0 top
UEXT1  BH10S  [ML10-MALE]  74.3,4.45 0 top
UEXT2  BH10S  [ML10-MALE]  94.61,4.45 0 top
USB_HOST1  USB_A_VERTICAL  [USB_A_VERTICAL_PTH]  120.65,44.58 90 top
USB_HOST2  USB_A_VERTICAL  [USB_A_VERTICAL_PTH]  120.65,54.1 90 top
USB_HOST3  USB_A_VERTICAL  [USB_A_VERTICAL_PTH]  120.65,63.63 90 top
USB_HOST4  USB_A_VERTICAL  [USB_A_VERTICAL_PTH]  120.65,73.15 90 top
USB_OTG  USB-OTG  [USB_MINI_9PIN]  106.68,36.96 0 top
USB_PWR_E  HN1x2(Open)  [JP1]  107.44,7.62 90 top
VGA_DB15-F  VGA15-F  [DB15-F_22MM]  5.08,64.77 270 top
WAKE-UP  T1157  [T1157]  40.77,72.52 270 top

## Tracks (layer width: path | path; a pad name or v marks a point on that pad's centre or on a via)
#OVCUR1
  Top 0.305: U4.21 77.78,69.02 77.47,68.71 76.96,68.71 76.2,67.94
  Top 1.016: R34.2 R32.1 76.2,67.94
+5V  (via drill 0.6)
  Top 0.305: U4.23 79.08,69.05 v78.36,68.33
  Top 0.508: v92.58,70.36 92.08,69.85 90.17,69.85 C18.1 89.15,72.46 U3.5 | 67.69,76.45 67.82,76.58 67.82,77.72 68.71,78.61 R22.2 | D5.2 25.55,81.03 18.54,81.03 18.41,80.9 | D6.2 26.23,69.02 25.65,69.6 24.13,69.6 23.37,70.36 20.95,70.36 v19.94,69.34 | v92.96,32.77 93.03,32.83 U1.5 93.03,35.37 C6.1
  Top 0.762: v90.17,33.91 AM3352-SOM-EVB-PLATFORM.3-1 | C22.1 77.72,67.69 v78.36,68.33 | v72.01,75.31 68.33,75.31 67.69,75.95 67.69,76.45 v61.47,76.45 | AM3352-SOM-EVB-PLATFORM.2-1 v62.48,58.29 62.36,58.42 62.36,64.26 59.94,66.67 v59.94,66.93 | v14.61,82.8 16.51,82.8 18.41,80.9 R88.2 | R87.2 19.43,69.34 v19.94,69.34 | v32.38,55.88 32.26,56.01 32.26,57.28 32.77,57.78 34.04,57.78 34.29,58.04 AM3352-SOM-EVB-PLATFORM.1-1 | v58.42,33.4 AM3352-SOM-EVB-PLATFORM.4-1
  Top 1.016: R86.1 98.81,84.58 5V_E.2 v97.54,84.45 96.01,85.98 96.01,87.63 v94.49,89.15 | C22.1 C21.1 | LCD.1 v8,87.25 | v5.33,79.38 v5.33,74.04 5.33,72.26 4.83,71.75 4.83,59.82 6.86,57.78 10.79,57.78 12.32,56.26 v12.32,53.85 12.32,46.35 10.41,44.45 10.41,33.27 11.56,32.13 v11.56,8.89
  Bottom 0.508: v78.36,68.33 77.6,68.33 72.01,73.91 v72.01,75.31
  Bottom 0.762: v61.47,76.45 61.02,76.45 60.2,75.63 60.2,67.18 v59.94,66.93 | v19.94,69.34 17.02,69.34 15.88,70.48 14.22,70.48 10.67,74.04 v5.33,74.04 | v32.38,55.88 30.61,54.1 25.78,54.1 24.89,54.99 13.46,54.99 v12.32,53.85 | v62.48,58.29 62.36,58.17 62.36,53.59 62.1,53.59 62.1,37.34 58.42,33.66 v58.42,33.4
  Bottom 1.016: USB_PWR_E.2 102.74,7.62 95.12,15.24 95.12,32.77 | v97.54,84.45 97.54,82.17 92.58,77.22 v92.58,70.36 95.12,67.82 95.12,32.77 | 61.47,89.15 v94.49,89.15 | 61.47,89.15 v61.47,76.45 | 61.47,89.15 9.91,89.15 v8,87.25 | v5.33,79.38 10.41,84.45 LCD.1 12.45,82.8 v14.61,82.8 | GPIO-EXT.1 9.02,4.95 9.02,6.35 v11.56,8.89 | 95.12,32.77 v92.96,32.77 91.31,32.77 v90.17,33.91
+5V_OTG_PWR  (via drill 0.6)
  Top 0.508: v100.97,33.66 101.22,33.66 101.98,34.42 101.98,35.36 USB_OTG.VBUS
  Top 1.016: L1.1 C4.1 100.46,33.15 v100.97,33.66
  Bottom 1.016: USB_PWR_E.1 105.41,10.92 105.41,14.48 100.46,19.43 100.46,33.15 v100.97,33.66
AIN4  (via drill 0.4)
  Top 0.127: 37.21,33.02 37.72,33.53 39.88,33.53 41.02,34.67 46.86,34.67 47.24,35.05 47.75,35.05 52.83,40.13 56.77,40.13 57.53,40.89 58.93,40.89 60.45,39.37 71.25,39.37 v71.75,38.86
  Top 0.508: 37.21,33.02 36.83,32.64 AM3352-SOM-EVB-PLATFORM.4-35
  Bottom 0.127: 55.24,4.45 55.24,6.1 56.01,6.86 58.04,6.86 58.29,7.11 62.61,7.11 69.47,13.97 69.47,26.67 70.74,27.94 70.74,35.43 71.5,36.2 71.5,38.61 v71.75,38.86
  Bottom 1.016: GPIO-EXT.35 55.24,4.45
AIN5  (via drill 0.4)
  Top 0.127: 35.94,33.02 36.45,33.53 37.34,33.53 37.59,33.78 39.75,33.78 40.89,34.92 46.74,34.92 47.12,35.31 47.62,35.31 52.7,40.39 56.64,40.39 57.4,41.15 59.05,41.15 60.58,39.62 71.88,39.62 72.39,39.12 72.39,38.1 v72.14,37.85
  Top 0.508: 35.94,33.02 35.56,32.64 AM3352-SOM-EVB-PLATFORM.4-37
  Bottom 0.127: 57.78,4.45 57.78,6.22 58.42,6.86 62.74,6.86 69.72,13.84 69.72,26.54 70.99,27.81 70.99,35.31 71.75,36.07 71.75,37.47 v72.14,37.85
  Bottom 1.016: GPIO-EXT.37 57.78,4.45
AIN6  (via drill 0.4)
  Top 0.127: 56.52,6.6 54.36,8.76 54.36,16.89 53.98,17.27 53.98,21.21 50.42,24.77 49.28,24.77 v48.64,25.4
  Top 0.508: AM3352-SOM-EVB-PLATFORM.4-38 v35.56,29.21
  Top 1.016: 56.52,6.6 GPIO-EXT.38
  Bottom 0.127: v35.56,29.21 36.7,28.07 40.51,28.07 43.69,24.89 48.13,24.89 v48.64,25.4
AIN7  (via drill 0.4)
  Top 0.127: 53.98,6.6 54.1,6.73 54.1,16.76 53.72,17.14 53.72,21.08 50.29,24.51 48.64,24.51 v47.62,25.53
  Top 0.508: v36.83,29.21 AM3352-SOM-EVB-PLATFORM.4-36
  Top 1.016: GPIO-EXT.36 53.98,6.6
  Bottom 0.127: v47.62,25.53 47.24,25.15 43.81,25.15 40.64,28.32 37.72,28.32 v36.83,29.21
AVDD
  Top 0.254: 76.45,78.74 76.48,78.71 U4.10 | 79.63,79.5 79.73,79.4
  Top 0.305: 79.73,79.4 U4.5 | U4.1 84.04,77.06 84.84,77.85
  Top 0.762: 79.63,81.15 83.69,81.15 84.71,80.14 L7.2 | 76.45,80.14 76.58,80.26 76.58,80.77 76.96,81.15 79.63,81.15 | 79.63,81.15 C28.1
  Top 1.016: C27.1 76.45,80.14 76.45,78.74 | C28.1 79.63,79.5 | 84.84,77.85 C29.1 85.22,79.12 L7.2
CAN_RX
  Top 0.127: 62.74,19.94 63.5,19.94 67.06,23.5 71.63,23.5 72.9,24.77 74.42,24.77 75.18,25.53 86.36,25.53 87.38,24.51 89.28,24.51 89.66,24.13 89.66,21.21 90.42,20.45 92.33,20.45
  Top 0.508: 92.33,20.45 U6.4
  Top 1.016: CAN1_RX/CAN0_RX.2 62.74,19.94
CAN_TX  (via drill 0.4)
  Top 0.127: 93.22,24.64 93.09,24.77 87.5,24.77 86.49,25.78 75.06,25.78 74.3,25.02 72.77,25.02 71.5,23.75 66.93,23.75 64.39,21.21 v60.58,21.21
  Top 0.508: 93.22,24.64 93.6,24.26 U6.1
  Bottom 0.127: 57.78,20.7 58.29,21.21 v60.58,21.21
  Bottom 1.016: CAN1_TX/CAN0_TX.2 57.78,20.7
CANH  (via drill 0.6)
  Top 0.508: v103.12,24.13 101.98,22.99 U6.7 98.3,22.99 96.52,21.21 96.52,20.95
  Top 0.762: R42.2 96.52,18.86 96.52,20.95
  Bottom 1.016: CAN.3 103.12,23.33 v103.12,24.13
CANL
  Top 0.508: 101.6,21.72 U6.6 | CAN_T.2 100.46,16.76
  Top 0.762: 100.46,16.76 101.6,17.91 101.6,21.72
  Top 1.016: CAN.2 102.6,21.72 101.6,21.72
COL
  Top 0.127: 32.13,41.76 33.25,41.76 R111.2 | U2.15 32.13,41.76 | 32.13,41.76 32.13,46.61 32.26,46.74 38.35,46.74 38.99,47.37 RM1.3.2
CRS
  Top 0.127: U2.14 31.52,41.27 33.66,41.27 R113.2
DM1
  Top 0.254: 104.78,46.48 104.78,45.97 102.36,43.56 99.82,43.56 98.81,44.58 96.9,44.58 89.41,52.07 89.41,64.01 87.88,65.53 83.06,65.53 81.68,66.91 U4.27
  Top 1.016: 104.78,46.48 105.9,47.61 USB_HOST1.2
DM2  (via drill 0.6)
  Top 0.254: v92.08,55.12 92.2,54.99 99.57,54.99 100.97,56.39 105.03,56.39
  Top 0.305: v81.28,74.17 81.68,74.57 U4.2
  Top 1.016: USB_HOST2.2 105.9,57.26 105.03,56.39
  Bottom 0.254: v92.08,55.12 92.46,55.5 92.46,58.04 89.92,60.58 89.92,62.74 80.9,71.75 80.9,73.79 v81.28,74.17
DM3  (via drill 0.4, 0.6)
  Top 0.254: v91.31,60.71 92.2,61.59 92.2,62.36 96.01,66.17 99.57,66.17 99.95,65.79 105.03,65.79 | U4.8 77.78,75.49 v77.6,75.31
  Top 1.016: USB_HOST3.2 105.9,66.66 105.03,65.79
  Bottom 0.254: v77.6,75.31 78.61,76.33 81.03,76.33 82.17,75.18 82.17,71.37 90.42,63.12 90.42,61.59 v91.31,60.71
DM4  (via drill 0.4)
  Top 0.254: v77.34,72.9 77.6,72.64 82.17,72.64 87,67.82 92.96,67.82 94.74,69.6 94.74,76.71 96.65,78.61 98.42,78.61 100.84,81.03 102.11,81.03 103,80.14 103,79.38 105.41,76.96 | v75.56,74.93 75.56,75.56 75.83,75.83 U4.11
  Top 1.016: USB_HOST4.2 105.77,76.6 105.41,76.96
  Bottom 0.254: v77.34,72.9 77.22,72.9 75.56,74.55 v75.56,74.93
DP1
  Top 0.254: 102.87,46.86 100.58,46.86 98.81,45.09 97.16,45.09 89.92,52.32 89.92,64.26 88.14,66.04 83.31,66.04 82.33,67.02 U4.28
  Top 1.016: USB_HOST1.3 103.9,47.89 102.87,46.86
DP2  (via drill 0.6)
  Top 0.254: v91.57,56.26 92.2,56.26 92.96,55.5 95.76,55.5 97.03,56.77 99.06,56.77 101.09,58.8 103,58.8
  Top 0.305: U4.3 81.03,75.7 v80.64,75.31
  Top 1.016: USB_HOST2.3 103.9,57.9 103,58.8
  Bottom 0.254: v91.57,56.26 91.95,56.64 91.95,57.78 89.41,60.33 89.41,62.48 80.39,71.5 80.39,75.06 v80.64,75.31
DP3  (via drill 0.4, 0.6)
  Top 0.254: v76.52,75.37 77.13,75.99 U4.9 | 103,68.33 100.84,68.33 100.46,67.94 98.55,67.94 97.28,66.67 95.76,66.67 91.31,62.23 v91.31,61.98
  Top 1.016: USB_HOST3.3 103.9,67.42 103,68.33
  Bottom 0.254: v76.52,75.37 77.98,76.83 81.28,76.83 82.68,75.44 82.68,71.63 91.31,62.99 91.31,62.48 v91.31,61.98
DP4  (via drill 0.4)
  Top 0.254: v76.2,72.77 76.83,72.14 81.92,72.14 86.74,67.31 93.22,67.31 95.25,69.34 95.25,76.45 96.9,78.11 100.33,78.11 100.58,77.85 102.87,77.85 | v74.49,75.06 74.49,75.25 75.18,75.94 | 75.18,75.94 75.18,75.95 | 75.18,75.94 U4.12
  Top 1.016: USB_HOST4.3 103.9,76.82 102.87,77.85
  Bottom 0.254: v74.49,75.06 74.49,74.87 76.2,73.15 v76.2,72.77
DVDD1  (via drill 0.6)
  Top 0.305: U4.24 79.73,71.15 79.38,71.5 | 74.53,71.5 U4.16
  Top 0.508: 79.38,71.5 74.53,71.5 73.28,71.5 v73.03,71.25 72.77,71.25 70.1,68.58 C31.1
  Top 1.016: v86.74,81.03 L7.1 | R23.1 R25.1 C30.1 C31.1
  Bottom 0.508: v73.03,71.25 73.03,71.75 70.99,73.79 70.99,77.09 75.18,81.28 86.49,81.28 v86.74,81.03
ECOL
  Top 0.127: RM3.3.2 36.7,23.24 37.34,22.61 38.1,22.61 39.37,21.34 39.37,20.32 38.35,19.3 34.54,19.3 R112.2 33.4,19.43 33.4,19.81 32.89,20.32 32.13,20.32 31.98,20.17 U5.15
ECRS
  Top 0.127: U5.14 31.86,19.67 32.26,20.07 32.77,20.07 33.15,19.68 33.15,19.3 33.53,18.92 33.53,18.41 R114.2
ENRST
  Top 0.254: U5.19 29.83,23.5
  Top 0.508: R36.2 R35.2
  Top 1.016: C45.2 29.83,23.5 R36.2 | R35.2 R37.2
ERXCK
  Top 0.127: U5.7 30.33,16.02 30.48,15.88 31.75,15.88 R106.2 34.54,13.08 34.92,13.08 RM4.4.1
ERXD0
  Top 0.127: RM3.2.2 37.47,23.24 37.85,22.86 38.23,22.86 39.62,21.46 39.62,20.19 38.48,19.05 37.97,19.05 37.08,18.16 R99.2 36.7,17.4 32.64,17.4 31.86,18.17 U5.11
ERXD1
  Top 0.127: RM3.1.2 38.35,23.11 39.88,21.59 39.88,20.07 38.61,18.8 38.1,18.8 37.59,18.29 37.59,17.27 R100.2 36.7,17.14 32.38,17.14 31.86,17.67 U5.10
ERXD2
  Top 0.127: U5.9 31.72,17.17 33.27,15.62 R101.2 34.54,15.11 35.43,15.11 35.69,15.37 36.2,15.37 36.58,14.99 36.58,13.97 37.47,13.08 RM4.2.1
ERXD3
  Top 0.127: U5.8 30.83,16.28 30.99,16.13 32.13,16.13 33.66,14.61 R102.2 34.54,14.1 36.07,14.1 36.7,13.46 RM4.3.1
ERXDV
  Top 0.127: U5.26 26.18,20.17 25.91,20.45 R104.2
ERXERR  (via drill 0.4)
  Top 0.127: RM4.1.1 38.1,12.45 38.1,15.24 37.47,15.88 35.69,15.88 35.43,16.13 34.54,16.13 R108.2 33.4,16.64 v33.27,16.51 | v32.51,19.43 32.25,19.17 U5.13
  Bottom 0.127: v32.51,19.43 32,18.92 32,17.78 v33.27,16.51
ETXCK
  Top 0.127: U5.20 29.33,21.85 27.94,23.24 R110.2
ETXD4  (via drill 0.4)
  Top 0.127: U5.18 30.33,22.08 v30.61,22.35
  Top 0.254: T2.1 21.59,25.42 v21.59,24.38 20.95,24.38 R116.2
  Bottom 0.127: v21.59,24.38 22.23,23.75 29.21,23.75 v30.61,22.35
EXT_WAKEUP  (via drill 0.4, 0.6)
  Top 0.127: v57.66,71.12 57.4,70.87 57.4,68.33 57.78,67.94 64.01,67.94 64.52,67.44 v64.52,66.93 | v72.64,30.23 73.15,29.72 77.72,29.72 77.98,29.46 | v71.37,40.51 70.74,41.15 64.39,41.15 v64.01,40.77
  Top 0.508: v45.47,71.75 45.72,71.75 46.35,71.12 R54.1 | AM3352-SOM-EVB-PLATFORM.3-20 78.74,28.7 77.98,29.46
  Bottom 0.127: v57.66,71.12 57.53,71.25 45.97,71.25 v45.47,71.75 | 40.64,5.08 40.13,4.57 40.13,2.54 40.64,2.03 59.69,2.03 60.45,2.79 60.45,3.81 70.23,13.59 70.23,26.29 72.64,28.7 v72.64,30.23 71.75,31.11 71.75,34.92 73.28,36.45 73.28,38.61 v71.37,40.51 | v64.01,40.77 64.39,41.15 64.39,55.63 65.15,56.39 65.15,64.9 64.9,65.15 64.9,66.55 v64.52,66.93
  Bottom 1.016: 40.64,5.08 GPIO-EXT.26
GND  (via drill 0.4, 0.6)
  Top 0.254: D2.1 16.96,67.12 17.91,68.07 17.91,69.72 18.66,70.48 U7.10 | U8.10 21.98,59.81 22.99,58.8 | U9.10 18.66,49.15 18.54,49.02 | 70.87,86.11 70.48,85.72 v66.04,85.72 | v57.91,74.93 58.04,74.8 58.04,72.64 58.29,72.39 59.82,72.39 60.83,71.37 60.83,69.85 | 91.19,87.88 90.81,88.27 88.27,88.27 87.88,87.88 | 86.23,87.76 85.72,88.27 83.19,88.27 82.8,87.88 | 70.87,87.88 70.48,88.27 66.67,88.27 v66.04,87.63 | 62.74,54.36 63.12,53.98 64.39,53.98 64.9,54.48 | 43.81,69.09 43.31,69.6
  Top 0.305: 73.53,77.85 73.88,77.85 U4.14 | 73.5,69.98 73.88,69.98 U4.15
  Top 0.406: L10.1 95.5,63.75 95,63.25
  Top 0.508: 81.97,17.02 U10.4 | C6.2 93.98,34.67 U1.2 | v90.55,73.41 U3.2 | U6.2 96.52,22.99 97.92,24.38 97.92,25.27 | v27.69,78.11 28.83,78.11 29.84,77.09 C57.2 | C59.2 29.21,55.24 v27.05,55.24 | v15.37,48.39 15.62,48.64 18.16,48.64 18.54,49.02 | 41.15,52.07 41.02,52.2 35.56,52.2 33.91,50.55 32.38,50.55 32,50.16 32,49.99 | 31.24,30.23 31.42,30.23 32.13,30.94 32.13,31.24 | RM2.4.2 RM2.3.2 RM2.2.2 | 63.12,14.73 62.74,14.73 59.44,18.03 59.44,25.53 58.42,26.54 AM3352-SOM-EVB-PLATFORM.4-2 | USB_OTG.GND 103.5,38.56 v103.5,39.88 | C60.2 96.33,47.88 94.74,49.47 94.74,52.07 | U10.4 v79.25,15.88 | U10.4 83.57,15.88 84.71,17.02
  Top 0.61: U6.2 91.95,22.99 C47.2
  Top 0.762: AM3352-SOM-EVB-PLATFORM.3-4 AM3352-SOM-EVB-PLATFORM.3-2 90.17,28.32 90.55,28.32 v91.19,28.96 | C18.2 90.55,71.25 v90.55,73.41 90.55,75.31 90.04,75.82 R19.1 | v80.64,65.15 80.01,65.79 C21.2 | 64.77,63.88 AM3352-SOM-EVB-PLATFORM.2-4 | AM3352-SOM-EVB-PLATFORM.2-2 v63.5,63.88 64.77,63.88 | 68.33,64.9 67.31,63.88 64.77,63.88 | AM3352-SOM-EVB-PLATFORM.1-4 AM3352-SOM-EVB-PLATFORM.1-2 34.16,62.23 32.38,62.23 31.5,63.12 31.5,64.77 30.61,65.66 C58.2 | FET3.2 21.99,80.01 v21.08,80.01 | v27.69,78.11 26.57,78.11 D5.1 | D6.1 26.82,67.06 27.94,67.06 v28.07,66.93 | 28.45,30.23 v28.45,33.53 28.45,34.67 | 24.64,30.23 28.45,30.23 | 32,49.99 C14.1 | v44.2,49.28 43.94,49.28 41.15,52.07 | 28.45,30.23 31.24,30.23 | 32.13,31.24 32.13,33.4 32.89,34.16 C11.1 | C10.1 34.54,34.8 35.56,34.8 36.07,35.31 RM2.4.2 | C46.1 21.34,17.14 v21.72,17.53 | v28.7,12.7 28.7,9.4 | 28.7,9.4 25.53,9.4 24.64,10.29 R93.2 C36.1 | 28.7,9.4 31.88,9.4 32.77,10.29 C39.1 | C40.1 34.42,10.67 RM4.4.2 RM4.3.2 RM4.2.2 RM4.1.2 38.99,10.67 v42.67,14.35 | AM3352-SOM-EVB-PLATFORM.4-2 AM3352-SOM-EVB-PLATFORM.4-4 | USB_HOST2.4 100.99,57.55 99.31,55.88 v97.66,55.88 | v73.25,77.72 v73.25,76.71 73.53,76.71 73.53,77.85
  Top 1.016: 85.47,0.89 v85.47,2.16 | 67.56,0.89 85.47,0.89 | UEXT1.2 68.83,5.71 67.56,4.45 67.56,0.89 | 67.56,0.89 10.03,0.89 9.02,1.91 9.02,5.71 GPIO-EXT.2 GPIO-EXT.4 | 107.57,11.05 105.54,11.05 v103.38,8.89 103.38,4.06 100.2,0.89 85.47,0.89 | v100.97,34.92 C4.2 98.68,34.92 97.92,34.16 R4.1 R3.1 C64.2 C63.2 | C51.- 84.71,17.02 81.97,17.02 v76.45,17.02 75.62,17.02 v74.8,17.83 74.8,18.41 C53.2 73.91,19.3 71.75,19.3 C54.2 C55.2 C56.2 R85.2 R84.2 63.12,14.73 | C52.2 74.8,10.92 v76.45,10.92 | C16.2 104.01,50.42 101.9,48.31 USB_HOST1.4 101.75,47.88 C61.2 C60.2 | v104.01,60.58 C19.2 | v104.01,70.1 C24.2 | v104.01,79.63 C32.2 | v77.85,78.87 C28.2 | 87.63,75.95 R20.1 | 87.63,75.95 R21.2 87.63,77.47 | 87.63,75.95 R19.1 | v97.66,88.27 PWR_LED.C | v93.73,83.69 93.73,85.34 JTAG.20 91.19,87.88 | v88.14,77.47 87.63,77.47 | 87.63,77.47 87.38,77.47 C29.2 | 97.92,25.27 R41.2 | v82.93,78.87 R33.1 | 73.53,78.61 73.53,77.85 | 73.53,78.61 C27.2 R52.1 | R24.2 C23.1 | C23.1 73.53,78.61 | C21.2 C22.2 | v74.93,72.52 72.52,72.52 v70.36,70.36 68.58,68.58 68.33,68.58 | v74.68,64.39 R34.1 | 68.33,64.9 C30.2 C31.2 68.33,68.58 | v62.74,71.88 63.75,70.87 C43.1 C41.1 65.79,69.6 66.8,68.58 68.33,68.58 | v48.39,73.28 R55.2 C48.2 | D1.1 16.4,77.47 v15.49,77.47 | D2.1 16.4,66.8 v15.49,66.8 | v28.07,66.93 29.59,66.93 30.23,66.29 C58.2 | FET2.2 22.37,69.34 v21.46,69.34 | D3.1 16.78,56.13 v15.75,56.13 | 22.99,58.8 23.43,58.35 FET1.2 23.94,58.35 25.02,57.28 v25.02,56.9 | v73.15,69.98 73.5,69.98 | R15.2 v21.72,44.2 21.97,44.2 22.61,43.56 C8.1 C9.1 | v20.57,38.1 C15.1 | R14.1 C7.1 24.64,30.23 v24.64,29.34 | C12.1 28.45,34.67 C13.1 | C1.1 v33.78,45.97 C3.1 C2.1
  Top 1.016: C11.1 C10.1 | R39.2 v21.72,22.48 22.86,22.48 | 22.86,22.48 C38.1 | 22.86,22.48 C37.1 | v28.7,12.7 28.7,13.84 | 28.7,13.84 C42.1 | 28.7,13.84 C44.1 | C36.1 R38.1 | C39.1 C40.1 | C34.1 C35.1 v35.05,21.84 C26.1 | v29.21,26.42 C45.1 | v46.74,16.13 LED2.C | v45.21,16.13 LED3.C | D4.A 98.44,14.73 v100.2,14.73 | v62.74,74.93 v57.91,74.93 | L3.1 100.33,39.88 v103.5,39.88 | USB_HOST3.4 101.88,67.06 v99.06,67.06 | C17.2 v97.66,58.17 C62.2 | v99.06,68.83 C25.2 C20.2 | C5.2 C33.2 101.88,76.58 USB_HOST4.4 | v90.55,23.24 C47.2 | v96.39,35.94 95.25,35.94 C6.2 | L10.1 96.52,64.52 97.28,65.28 v99.06,65.28 | C23.1 R52.1 | 70.87,86.11 JTAG.4 70.87,87.88 | 87.88,87.88 JTAG.16 86.23,87.76 | 82.8,87.88 JTAG.12 | v22.99,29.34 20.83,29.34 v20.57,29.59 R9.2 v20.57,31.88 | v20.57,9.14 R30.2 v20.57,11.43 | v2.16,27.18 C214.1 | v15.37,45.85 v15.37,48.39 | v18.8,25.15 R116.1 | R52.1 v72.01,81.92
  Top 1.676: 107.57,11.05 108.73,12.21 PWR.- 108.73,17.88 108.33,18.29 105.66,18.29 | PWR.-- 105.58,18.29 105.66,18.29 | 105.66,18.29 104.01,18.29
  Top 1.778: D4.A 93.07,14.75 C51.-
  Bottom 0.254: 20.32,25.4 28.19,25.4 v29.21,26.42 | 91.19,87.88 90.81,88.27 88.27,88.27 87.88,87.88 | 86.11,87.88 85.72,88.27 83.19,88.27 82.8,87.88 | 75.95,87.88 75.56,88.27 73.03,88.27 72.64,87.88 | 75.95,86.11 75.56,85.72 73.03,85.72 72.64,86.11 | 70.87,87.88 70.48,88.27 66.67,88.27 v66.04,87.63
  Bottom 0.508: v91.19,28.96 92.08,28.07 92.08,24.77 v90.55,23.24
  Bottom 0.762: v80.64,65.15 80.64,67.82 78.99,69.47 77.98,69.47 v74.93,72.52 | 13.84,77.47 13.84,80.26 14.86,81.28 15.88,81.28 17.14,80.01 v21.08,80.01 25.78,80.01 v27.69,78.11 | v27.05,55.24 26.67,55.24 v25.02,56.9 | C68.1 20.45,41.78 20.45,42.04 20.19,42.29 20.19,44.2 | U2.EP1 29.08,41.27 v33.78,45.97 33.91,46.1 43.18,46.1 44.07,46.99 44.07,49.15 v44.2,49.28 | v42.67,14.35 44.45,16.13 v45.21,16.13 v46.74,16.13 47.88,16.13 UART0.3
  Bottom 1.016: 2.54,77.22 2.54,81.28 | VGA_DB15-F.GND2 8.89,57.02 | 8.89,57.02 7.19,57.02 2.54,61.67 2.54,71.5 | 2.54,71.5 2.54,77.22 | 2.54,81.28 GND_PIN.P$1 | 2.54,81.28 4.06,81.28 9.78,87 10.67,87 | 10.67,87 LCD.2 | 10.67,87 LCD.4 | 2.54,77.22 8.84,77.22 VGA_DB15-F.GND1 9.09,77.47 13.84,77.47 v15.49,77.47 | 8.89,57.02 VGA_DB15-F.6 VGA_DB15-F.7 VGA_DB15-F.8 | 8.89,69.6 VGA_DB15-F.10 | 8.89,69.6 6.99,71.5 2.54,71.5 | 8.89,69.6 11.42,69.6 VGA_DB15-F.5 14.21,66.8 v15.49,66.8 23.88,66.8 26.16,64.52 27.69,64.52 28.07,64.9 v28.07,66.93 25.65,69.34 v21.46,69.34 | 103.5,34.92 103.5,29.72 101.85,28.07 101.85,19.94 103.55,18.24 PWR.-- 108.84,18.24 | 103.5,34.92 v100.97,34.92 | v103.38,8.89 100.2,12.06 v100.2,14.73 | v85.47,2.16 89.03,5.71 UEXT2.2 | 103.5,34.92 v103.5,39.88 103.5,46.1 101.9,47.71 USB_HOST1.4 101.9,48.31 104.01,50.42 104.01,55.24 101.9,57.36 USB_HOST2.4 101.9,57.83 104.01,59.94 v104.01,60.58 104.01,64.77 101.9,66.88 USB_HOST3.4 101.9,67.48 104.01,69.6 v104.01,70.1 104.01,74.3 101.9,76.41 USB_HOST4.4 101.9,76.88 104.01,78.99 v104.01,79.63 103.12,80.52 103.12,85.22 101.35,87 97.66,87 | 97.66,87 v97.66,88.27 | 97.66,87 JTAG.20 91.19,87.88 | v93.73,83.69 88.9,78.87 88.14,78.87 | 88.14,78.87 v82.93,78.87 v77.85,78.87 v75.06,78.87 74.17,78.87 v73.79,78.49 73.28,77.98 73.28,74.17 v74.93,72.52 | 88.14,78.87 v88.14,77.47 | v74.68,64.39 74.68,68.45 v73.15,69.98 70.74,69.98 v70.36,70.36 | v62.74,71.88 v62.74,74.93 | v25.02,56.9 16.51,56.9 v15.75,56.13 12.75,56.13 VGA_DB15-F.GND2 | v21.72,44.2 R15.2 20.19,44.2 17.02,44.2 v15.37,45.85 | C68.1 C69.1 v20.57,38.1 22.73,38.1 25.15,40.51 U2.EP1 28.45,39.88 v28.45,33.53
  Bottom 1.016: U5.EP1 28.7,18.54 v28.7,12.7 | 20.32,24.13 20.32,23.88 v21.72,22.48 | 18.8,24.13 12.45,24.13 9.53,21.21 5.46,21.21 3.94,22.73 3.94,25.4 v2.16,27.18 | 18.8,24.13 20.32,24.13 | v24.64,29.34 v22.99,29.34 20.32,26.67 20.32,25.4 20.32,24.13 | v76.45,17.02 v76.45,10.92 | v57.91,74.93 56.39,73.41 48.51,73.41 v48.39,73.28 | v97.66,55.88 v97.66,58.17 | v99.06,67.06 v99.06,68.83 | JTAG.8 JTAG.10 JTAG.12 82.8,87.88 | 87.88,87.88 JTAG.16 86.11,87.88 | 72.64,87.88 JTAG.4 | JTAG.8 75.95,87.88 | 72.64,86.11 JTAG.4 | JTAG.8 75.95,86.11 | JTAG.4 70.87,87.88 | U5.EP1 25.53,22.48 v21.72,22.48 | v21.72,22.48 21.72,20.95 | 21.72,20.95 21.72,18.67 | 21.72,18.67 v21.72,17.53 | U5.EP1 29.97,18.92 32.89,21.84 v35.05,21.84 | VGA_DB15-F.GND2 12.78,48.39 v15.37,48.39 | 18.8,24.13 v18.8,25.15 | 21.72,20.95 C72.1 | 21.72,18.67 C73.1 | C70.1 C71.1 v20.57,11.43 | v20.57,31.88 C67.1 C66.1
  other vias: 82.55,6.35 86.36,6.35 104.14,3.68 104.14,1.14 70.36,71.63 58.42,77.47 83.44,76.2 79.38,73.53 89.66,82.42 104.39,84.45 104.14,89.03 50.8,48.26 53.34,48.26 55.88,48.26 55.88,45.72 53.34,45.72 50.8,45.72 48.26,45.72 48.26,43.18 50.8,43.18 53.34,43.18 55.88,43.18 48.26,40.64 45.72,43.18 45.72,40.64 43.18,40.64 43.18,38.1 45.72,38.1 50.8,55.88 53.34,55.88 71.12,48.26 73.66,48.26 76.2,48.26 78.74,48.26 81.28,48.26 81.28,50.8 71.12,45.72 73.66,45.72 76.2,45.72 78.74,45.72 81.28,45.72 81.28,43.18 78.74,43.18 76.2,43.18 73.66,43.18 71.12,43.18 73.66,40.64 76.2,40.64 78.74,40.64 81.28,40.64 78.74,38.1 76.2,38.1 87.63,49.53 87.63,46.99 87.63,44.45 90.17,41.91 90.17,39.37 87.63,39.37 87.63,36.83 96.52,43.18 96.52,40.64 46.35,55.88 37.47,54.61 87.63,52.07 76.2,55.88 73.66,54.61 66.04,83.82 63.88,79.38 53.34,81.28 53.34,78.74 53.34,76.2 49.53,80.01 48.26,67.31 45.72,77.47 62.74,78.36 65.02,72.26 65.02,75.31 58.42,80.01 36.83,72.39 32.38,72.39 32.38,69.85 30.23,66.93 36.83,68.71 39.88,82.55 37.21,81.66 33.66,78.74 19.68,81.92 53.34,73.66 57.15,26.42 58.42,26.42 59.25,27.81 60.96,29.21 59.69,30.48 41.27,25.4 41.02,17.21 42.67,12.57 39.37,13.97 43.18,19.05 43.18,16.51 49.53,15.88 48.9,13.34 52.07,15.88 52.07,17.78 55.88,14.61 59.82,16.13 62.23,3.81 66.04,3.81 98.04,16.76 81.28,29.59 74.17,23.62 72.9,22.35 87.63,22.86 87.63,20.32 88.9,13.97 79.25,17.02 104.14,6.22 5.08,1.27 6.35,6.48 7.62,6.6 1.27,50.8 1.27,53.34 1.27,55.88 1.27,58.42 1.27,60.96 1.27,63.5 1.27,66.04 1.27,68.58 1.27,71.12 1.27,73.66 1.27,76.2 1.27,78.74 4.06,83.19 33.02,60.33 38.1,45.72 44.2,47.12 63.12,45.09 63.12,47.62 63.12,42.55 90.3,35.31 93.73,38.48 70.48,8.89 82.55,3.68 86.36,3.68 42.55,71.75 42.55,74.3 42.55,76.83 7.62,84.84 42.42,51.56 96.14,82.93 108.97,81.66 105.54,74.3 57.78,56.77 52.64,29.46 92.58,51.94 79.25,14.73 79.25,13.59 85.22,11.68 72.26,69.34 71.5,68.58 57.78,55.24 93.73,81.79 104.39,85.98 104.39,87.5 102.87,87.5 109.09,89.03 107.44,81.66 105.92,84.45 92.84,80.64 71.63,71.63 69.09,70.36 63.25,65.28 75.95,64.14 73.41,64.14 72.14,64.14 70.87,64.14 78.49,64.01 79.38,64.01 93.98,61.85 93.98,60.83 66.04,63.88 69.09,69.09 67.82,68.58 52.32,70.1 52.32,67.18
  pour Top (isolate 0.381): -2.54,93.98 -2.54,48.26 17.78,48.26 17.78,9.27 -2.54,9.27 -2.54,-2.54 127,-2.54 127,93.98
  pour Bottom (isolate 0.381): -5.08,-5.08 129.54,-5.08 129.54,96.52 -5.08,96.52 -5.08,48.26 17.78,48.26 17.78,9.27 -5.08,9.27
  pour Bottom (rank 2, no thermals): 27.05,42.55 27.05,38.48 31.11,38.48 31.11,42.55
  pour Bottom (rank 2, no thermals): 27.05,20.95 27.05,16.89 31.11,16.89 31.11,20.95
GNDA  (via drill 0.4)
  Top 0.127: 59.05,6.6 58.29,7.37 56.13,7.37 54.61,8.89 54.61,17.02 54.23,17.4 54.23,21.34 50.16,25.4 v49.66,25.4
  Top 0.508: AM3352-SOM-EVB-PLATFORM.4-40 v34.29,29.21
  Top 1.016: 59.05,6.6 GPIO-EXT.40
  Bottom 0.127: v34.29,29.21 35.69,27.81 40.39,27.81 43.56,24.64 48.9,24.64 v49.66,25.4
JTAG_TCK  (via drill 0.4)
  Top 0.508: AM3352-SOM-EVB-PLATFORM.4-29 40.64,32.64 v41.53,33.53 | v66.8,77.47 R117.1 R31.1
  Bottom 0.127: v41.53,33.53 41.91,33.15 48.39,33.15 53.21,37.97 56.39,37.97 56.77,38.35 56.77,40.51 58.67,42.42 58.67,49.02 57.91,49.78 57.91,50.29 58.93,51.31 58.93,64.77 68.2,74.04 68.2,76.07 v66.8,77.47
JTAG_TDI  (via drill 0.4)
  Top 0.127: 39.62,32.77 39.88,33.02 40.13,33.02 41.27,34.16 47.12,34.16 47.5,34.54 48.01,34.54 53.09,39.62 57.53,39.62 v57.91,40.01
  Top 0.508: AM3352-SOM-EVB-PLATFORM.4-31 39.37,32.51 39.62,32.77
  Bottom 0.127: v57.91,40.01 57.91,40.51 59.44,42.04 59.44,64.52 68.71,73.79 68.71,78.23 69.34,78.87 69.34,82.04 71.12,83.82
  Bottom 1.016: 71.12,83.82 JTAG.3
JTAG_TDO  (via drill 0.4)
  Top 0.127: 38.48,33.02 38.73,33.27 40.01,33.27 41.15,34.42 46.99,34.42 47.37,34.8 47.88,34.8 52.96,39.88 56.9,39.88 57.66,40.64 58.29,40.64 v58.93,40.01
  Top 0.508: AM3352-SOM-EVB-PLATFORM.4-33 38.1,32.64 38.48,33.02
  Bottom 0.127: 76.2,83.82 75.44,83.06 70.74,83.06 69.6,81.92 69.6,78.74 68.96,78.11 68.96,73.66 59.69,64.39 59.69,41.91 58.93,41.15 v58.93,40.01
  Bottom 1.016: 76.2,83.82 JTAG.7
JTAG_TMS  (via drill 0.4)
  Top 0.508: AM3352-SOM-EVB-PLATFORM.4-32 v39.37,29.21
  Bottom 0.127: 69.22,83.57 69.09,83.44 69.09,78.99 68.45,78.36 68.45,73.91 59.18,64.64 59.18,42.16 57.28,40.26 57.28,37.59 57.66,37.21 57.66,36.32 55.63,34.29 55.63,33.53 54.99,32.89 52.32,32.89 49.78,30.35 40.51,30.35 v39.37,29.21
  Bottom 1.016: 69.22,83.57 JTAG.1
JTAG_TRST  (via drill 0.4)
  Top 0.127: v70.23,81.15 v68.45,81.15
  Top 0.508: AM3352-SOM-EVB-PLATFORM.4-30 40.64,28.96 v40.89,29.21 | v70.23,81.15 R52.2
  Bottom 0.127: v40.89,29.21 41.78,30.1 49.91,30.1 52.45,32.64 55.12,32.64 55.88,33.4 55.88,34.16 57.91,36.2 57.91,37.21 59.94,39.24 59.94,64.26 69.22,73.53 69.22,77.98 69.85,78.61 69.85,80.77 v70.23,81.15 | v68.45,81.15 68.07,81.53 68.07,85.85 68.45,86.23
  Bottom 1.016: 68.45,86.23 JTAG.2
LCD_BKL
  Top 0.127: 55.88,63.5 53.34,66.04 53.34,71.88 55.12,73.66 55.12,81.66 55.24,81.79 55.24,85.72
  Top 0.508: AM3352-SOM-EVB-PLATFORM.1-36 55.88,63.5
  Top 1.016: 55.24,85.72 LCD.36
LCD_LEFT/RIGHT
  Top 0.127: 54.61,60.33 53.98,60.96 53.98,63.75 51.31,66.42 51.31,83.69 51.44,83.82
  Top 0.508: AM3352-SOM-EVB-PLATFORM.1-33 54.61,60.33
  Top 1.016: 51.44,83.82 LCD.33
LCD_UP/DOWN
  Top 0.127: 54.61,63.5 51.56,66.55 51.56,82.8 52.7,83.95 52.7,85.72
  Top 0.508: AM3352-SOM-EVB-PLATFORM.1-34 54.61,63.5
  Top 1.016: 52.7,85.72 LCD.34
MMC0-SDCD#/EMU4  (via drill 0.4)
  Top 0.127: 80.39,32.77 80.77,33.15 82.8,33.15 83.82,34.16 83.82,47.12 v84.2,47.5 | v90.81,57.66 90.55,57.91 90.55,63.63 v92.71,65.79 | v91.95,79.12 91.95,83.31 92.08,83.44
  Top 0.508: AM3352-SOM-EVB-PLATFORM.3-17 80.01,32.38 80.39,32.77
  Top 1.016: 92.08,83.44 JTAG.19
  Bottom 0.127: v84.2,47.5 88.39,51.69 88.39,55.24 v90.81,57.66 | v92.71,65.79 91.69,66.8 91.69,78.87 v91.95,79.12
N$1
  Top 1.016: R49.2 LED2.A
N$2
  Top 0.254: U5.32 24.92,17.17 23.11,15.37 23.11,14.99
  Top 0.762: R38.2 23.11,14.99
N$3
  Top 0.508: U10.2 80.9,13.34 79.63,12.06 R69.1
  Top 1.016: C51.+ 89.28,10.41 R69.1
  Top 1.778: 102.23,11.94 100.84,10.54 98.57,10.54 D4.C 96.5,12.32 91.19,12.32 C51.+
  Top 2.54: 102.23,11.94 PWR.+ 102.23,14.86
N$4
  Top 0.508: U10.8 75.69,12.06 74.8,12.95 C52.1
N$5
  Top 0.254: U7.5 17.84,73.73 17.4,74.17
  Top 1.016: R78.1 17.4,74.17
N$6
  Top 0.508: R69.2 78.49,11.05 78.49,12.7 77.85,13.34 U10.7
N$7
  Top 0.508: U10.1 83.44,12.06 C49.1
N$8  (via drill 1)
  Top 0.508: U10.3 84.2,14.61 C49.2
  Top 1.016: L11.1 83.75,18.54 v86.36,18.54 | C49.2 v86.36,14.86
  Bottom 1.016: v86.36,14.86 v86.36,18.54
N$9
  Top 0.508: U10.6 73.79,14.61 C50.1
N$10  (via drill 0.4)
  Top 0.254: U5.2 27.83,15.89 27.69,15.75 26.42,15.75 v26.29,15.88 | v22.86,10.03 R93.1
  Bottom 0.254: 2.24,14.73 2.62,15.11 9.65,15.11 14.73,10.03 v22.86,10.03 22.86,10.92 26.54,14.61 26.54,15.62 v26.29,15.88
  Bottom 1.016: LAN2.AG 2.24,14.73
N$11
  Top 1.016: R84.1 C50.2
N$12  (via drill 0.6)
  Top 1.016: C56.1 C55.1 C54.1 v72.9,20.95 C53.1 L11.2 77.55,22.3 78.74,23.5 v79.88,23.5 | v101.73,84.45 5V_E.1 | v91.31,52.7 92.46,53.85 v98.04,53.85 | v72.9,18.03 72.64,18.03 71.88,17.27 R70.2